# Altium schematic sheet HEATER-SSR.SchDoc
size D; SheetNumber: 5; SheetTotal: 7
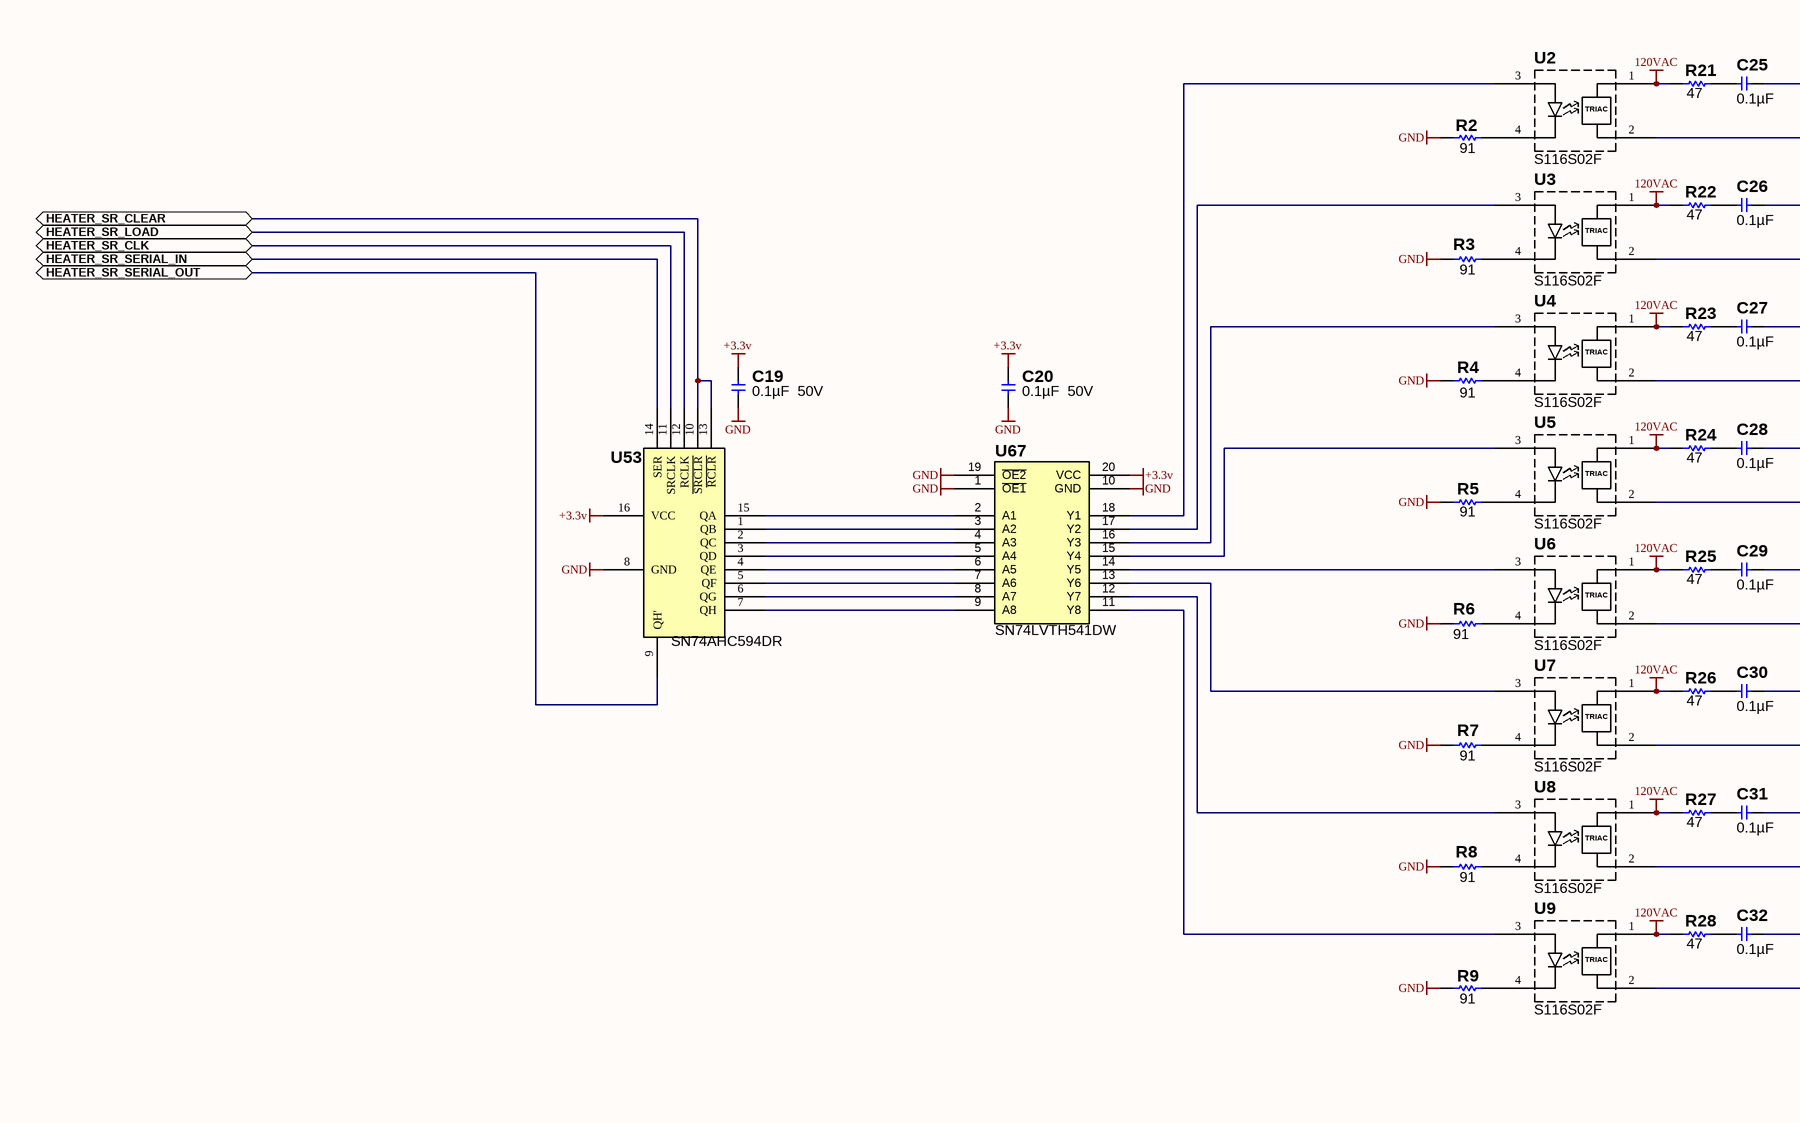
[diagram p0: HEATER-SSR.SchDoc, left]
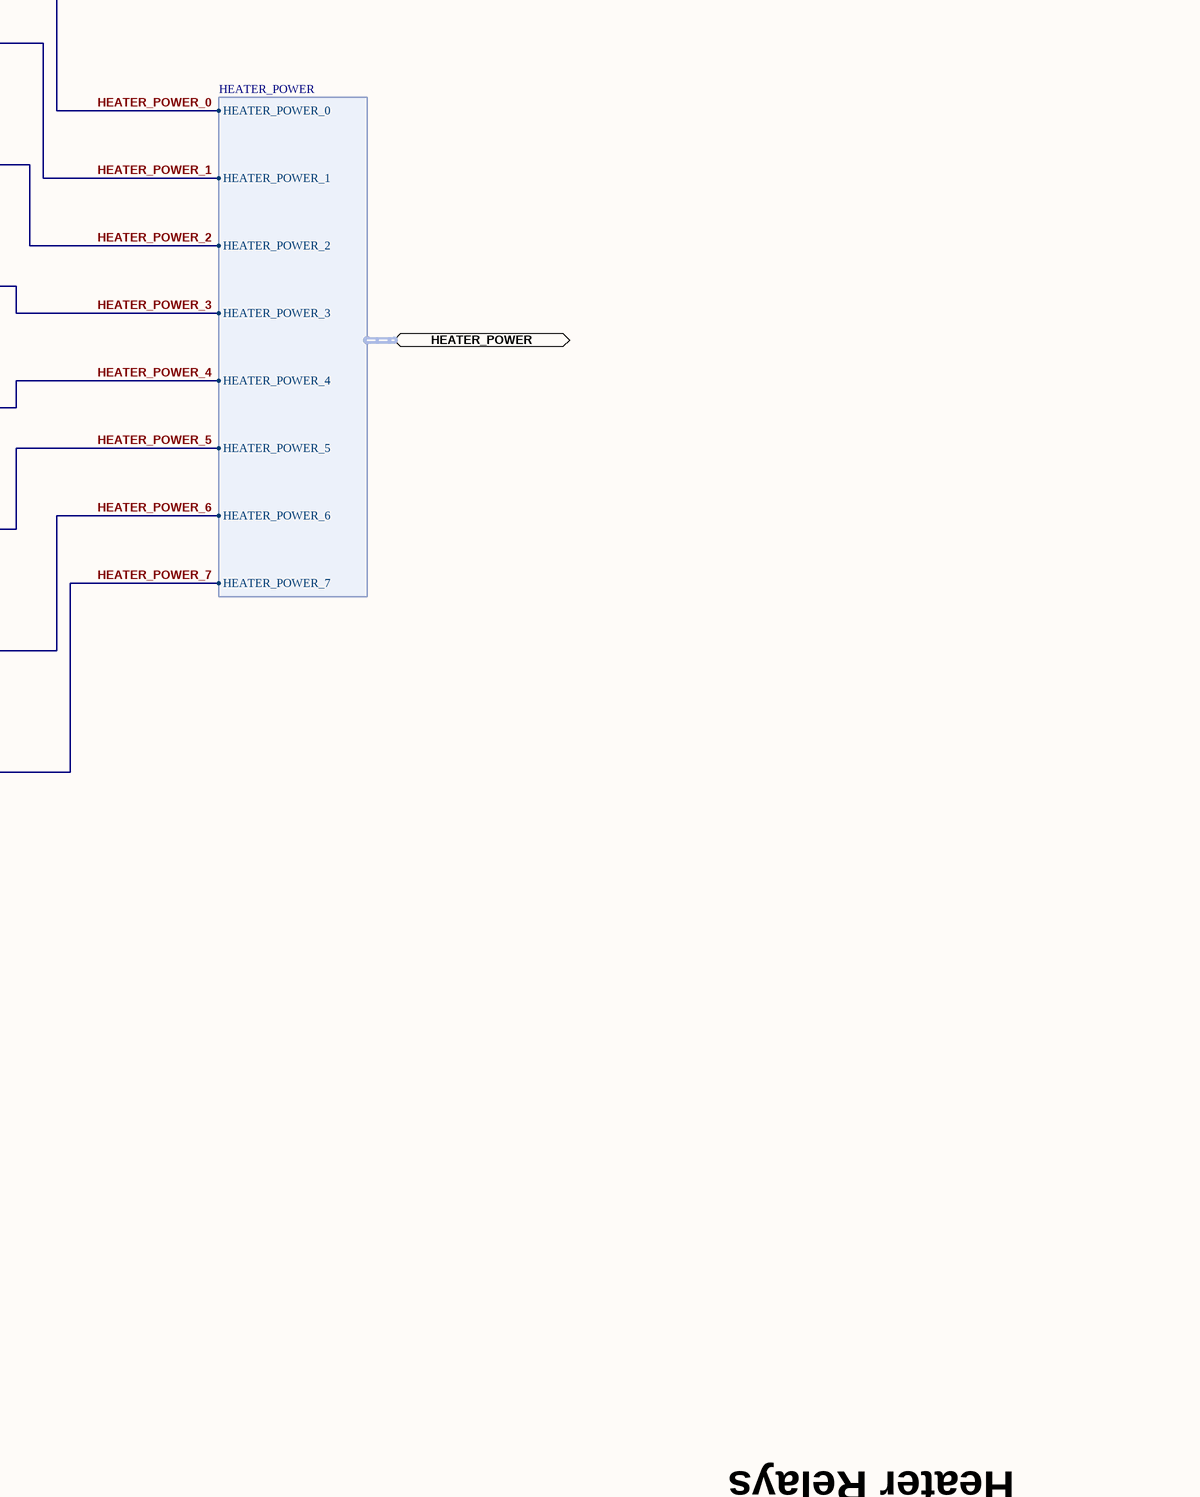
[diagram p1: HEATER-SSR.SchDoc, right]

## Parts
C19  0.1µF  50V  [C0805_LD]
C20  0.1µF  50V  [C0805_LD]
C25  0.1µF  [C1206_LD]
C26  0.1µF  [C1206_LD]
C27  0.1µF  [C1206_LD]
C28  0.1µF  [C1206_LD]
C29  0.1µF  [C1206_LD]
C30  0.1µF  [C1206_LD]
C31  0.1µF  [C1206_LD]
C32  0.1µF  [C1206_LD]
R2  91  [R0805_LD]
R3  91  [R0805_LD]
R4  91  [R0805_LD]
R5  91  [R0805_LD]
R6  91  [R0805_LD]
R7  91  [R0805_LD]
R8  91  [R0805_LD]
R9  91  [R0805_LD]
R21  47  [R1206_LD]
R22  47  [R1206_LD]
R23  47  [R1206_LD]
R24  47  [R1206_LD]
R25  47  [R1206_LD]
R26  47  [R1206_LD]
R27  47  [R1206_LD]
R28  47  [R1206_LD]
U2  S116S02F  [SHARP SIP-4 SSR]
U3  S116S02F  [SHARP SIP-4 SSR]
U4  S116S02F  [SHARP SIP-4 SSR]
U5  S116S02F  [SHARP SIP-4 SSR]
U6  S116S02F  [SHARP SIP-4 SSR]
U7  S116S02F  [SHARP SIP-4 SSR]
U8  S116S02F  [SHARP SIP-4 SSR]
U9  S116S02F  [SHARP SIP-4 SSR]
U53  SN74AHC594DR  [SOIC127P600X145-16L]
U67  SN74LVTH541DW  [SOIC127P1030X265-20L]

## Ports
HEATER_POWER (harness HEATER_POWER), HEATER_SR_CLEAR, HEATER_SR_CLK, HEATER_SR_LOAD, HEATER_SR_SERIAL_IN, HEATER_SR_SERIAL_OUT

## Harnesses
HEATER_POWER: HEATER_POWER_0, HEATER_POWER_1, HEATER_POWER_2, HEATER_POWER_3, HEATER_POWER_4, HEATER_POWER_5, HEATER_POWER_6, HEATER_POWER_7

## Nets
120VAC: R21.1 R22.1 R23.1 R24.1 R25.1 R26.1 R27.1 R28.1 U2.1 U3.1 U4.1 U5.1 U6.1 U7.1 U8.1 U9.1
+3.3v: C19.2 C20.2 U53.16(VCC) U67.20(VCC)
GND: C19.1 C20.1 R2.1 R3.1 R4.1 R5.1 R6.1 R7.1 R8.1 R9.1 U53.8(GND) U67.1(~{OE1}) U67.10(GND) U67.19(~{OE2})
HEATER_POWER_0: C25.2 U2.2 ; port HEATER_POWER.HEATER_POWER_0
HEATER_POWER_1: C26.2 U3.2 ; port HEATER_POWER.HEATER_POWER_1
HEATER_POWER_2: C27.2 U4.2 ; port HEATER_POWER.HEATER_POWER_2
HEATER_POWER_3: C28.2 U5.2 ; port HEATER_POWER.HEATER_POWER_3
HEATER_POWER_4: C29.2 U6.2 ; port HEATER_POWER.HEATER_POWER_4
HEATER_POWER_5: C30.2 U7.2 ; port HEATER_POWER.HEATER_POWER_5
HEATER_POWER_6: C31.2 U8.2 ; port HEATER_POWER.HEATER_POWER_6
HEATER_POWER_7: C32.2 U9.2 ; port HEATER_POWER.HEATER_POWER_7
HEATER_SR_CLEAR: U53.10(~{SRCLR}) U53.13(~{RCLR}) ; port HEATER_SR_CLEAR
HEATER_SR_CLK: U53.11(SRCLK) ; port HEATER_SR_CLK
HEATER_SR_LOAD: U53.12(RCLK) ; port HEATER_SR_LOAD
HEATER_SR_SERIAL_IN: U53.14(SER) ; port HEATER_SR_SERIAL_IN
HEATER_SR_SERIAL_OUT: U53.9(QH') ; port HEATER_SR_SERIAL_OUT
NetC25_1: C25.1 R21.2
NetC26_1: C26.1 R22.2
NetC27_1: C27.1 R23.2
NetC28_1: C28.1 R24.2
NetC29_1: C29.1 R25.2
NetC30_1: C30.1 R26.2
NetC31_1: C31.1 R27.2
NetC32_1: C32.1 R28.2
NetR2_2: R2.2 U2.4
NetR3_2: R3.2 U3.4
NetR4_2: R4.2 U4.4
NetR5_2: R5.2 U5.4
NetR6_2: R6.2 U6.4
NetR7_2: R7.2 U7.4
NetR8_2: R8.2 U8.4
NetR9_2: R9.2 U9.4
NetU2_3: U2.3 U67.18(Y1)
NetU3_3: U3.3 U67.17(Y2)
NetU4_3: U4.3 U67.16(Y3)
NetU5_3: U5.3 U67.15(Y4)
NetU6_3: U6.3 U67.14(Y5)
NetU7_3: U7.3 U67.13(Y6)
NetU8_3: U8.3 U67.12(Y7)
NetU9_3: U9.3 U67.11(Y8)
NetU53_1: U53.1(QB) U67.3(A2)
NetU53_2: U53.2(QC) U67.4(A3)
NetU53_3: U53.3(QD) U67.5(A4)
NetU53_4: U53.4(QE) U67.6(A5)
NetU53_5: U53.5(QF) U67.7(A6)
NetU53_6: U53.6(QG) U67.8(A7)
NetU53_7: U53.7(QH) U67.9(A8)
NetU53_15: U53.15(QA) U67.2(A1)

## Notes on the sheet
- Heater Relays
- -1
- Wavenumber LLC
- 2pl
- Rev:
- Sheet
- of
- (in symbol S116S02F) TRIAC

## Library data of the parts
C19 C20 = GRM21BR71H104KA01L: CAP CER 0.1UF 50V 10% X7R 0805; Manufacturer: Murata Electronics North America; Value: 0.1µF  50V; Temperature Coefficient: X7R; Manufacturer Part Number: GRM21BR71H104KA01L; ComponentLink1Description: \\altium.sil.arl.psu.edu\Libraries\datasheets\Murata Electronics North America\c02e.pdf; ComponentLink1URL: http://search.murata.co.jp/Ceramy/image/img/A01X/G101/ENG/GRM1555C1HR60WA01-01.pdf; ComponentLink2Description: External Datasheet; ComponentLink2URL: http://www.murata.com/products/catalog/pdf/c02e.pdf; Stocked: 0; Supplier 1: Digi-Key; Supplier Part Number 1: 490-1666-1-ND; Category: Capacitors; Sort Value: 100000; Sort Value Package: 0805_100000; Pricing: 1 = 0.1  ;  10 = 0.046  ;  50 = 0.0248  ;  100 = 0.0209  ;  250 = 0.01712  ;  500 = 0.01464  ;  1000 = 0.0114 (USD); Sales Status: Active; Capacitance: 0.1µF; Voltage - Rated: 50V; Tolerance: ±10%; Mounting Type: Surface Mount- MLCC; Operating Temperature: -55°C ~ 125°C; Applications: General Purpose; Ratings: -; Package / Case: 0805 (2012 Metric); Size / Dimension: 0.079" L x 0.049" W (2.00mm x 1.25mm); Height - Seated (Max): -; Thickness (Max): 0.053" (1.35mm); Lead Spacing: -; Features: -; Packaging: Cut Tape (CT); Lead Style: -; Package: 0805; Thickness: 135
C25-C32 = GRM31CR72E104KW03L: CAP CER 0.1UF 250V 10% X7R 1206; Manufacturer: Murata Electronics North America; Value: 0.1µF; Temperature Coefficient: X7R; Manufacturer Part Number: GRM31CR72E104KW03L; ComponentLink1Description: \\altium.sil.arl.psu.edu\Libraries\datasheets\Murata Electronics North America\c02e.pdf; ComponentLink1URL: http://search.murata.co.jp/Ceramy/image/img/A01X/G101/ENG/GRM1555C1HR60WA01-01.pdf; ComponentLink2Description: External Datasheet; ComponentLink2URL: http://www.murata.com/products/catalog/pdf/c02e.pdf; Stocked: 0; Supplier 1: Digi-Key; Supplier Part Number 1: 490-3542-1-ND; Category: Capacitors; Sort Value: 100000; Sort Value Package: 1206_100000; Pricing: 1 = 0.37  ;  10 = 0.308  ;  50 = 0.1732  ;  100 = 0.154  ;  250 = 0.11552  ;  500 = 0.10202  ;  1000 = 0.09048 (USD); Sales Status: Active; Capacitance: 0.1µF; Voltage - Rated: 250V; Tolerance: ±10%; Mounting Type: Surface Mount- MLCC; Operating Temperature: -55°C ~ 125°C; Applications: General Purpose; Ratings: -; Package / Case: 1206 (3216 Metric); Size / Dimension: 0.126" L x 0.063" W (3.20mm x 1.60mm); Height - Seated (Max): -; Thickness (Max): 0.071" (1.80mm); Lead Spacing: -; Features: -; Packaging: Cut Tape (CT); Lead Style: -; Package: 1206; Thickness: 180
R2-R9 = ERJ-6ENF91R0V: RES 91 OHM 1/8W 1% 0805 SMD; Manufacturer: Panasonic Electronic Components; Package Power: 0805  (0.125W); Power (Watts): 0.125W- 1/8W; Temperature Coefficient: ±100ppm/°C; Limiting Element Voltage: 150; Maximum Overload Voltage: 200; Maximum Working Voltage: 3.4V; Value: 91; Manufacturer Part Number: ERJ-6ENF91R0V; ComponentLink1Description: Internal Datasheet; ComponentLink1URL: \\altium.sil.arl.psu.edu\Libraries\datasheets\Panasonic Electronic Components\AOA0000CE2.pdf; ComponentLink2Description: External Datasheet; ComponentLink2URL: http://industrial.panasonic.com/www-data/pdf/AOA0000/AOA0000CE2.pdf; Stocked: 0; Supplier 1: Digi-Key; Supplier Part Number 1: P91.0CCT-ND; Category: Resistors; Resistance (Ohms): 91; Composition: Thick Film; Features: -; Tolerance: ±1%; Package / Case: 0805 (2012 Metric); Footprint: 805; Size / Dimension: 0.079" L x 0.049" W (2.00mm x 1.25mm); Height: 0.028" (0.70mm); Number of Terminations: 2; Packaging: Cut Tape (CT); Sort Value: 91; Sort Value Package: 805_91
R21-R28 = ERJ-8ENF47R0V: RES 47 OHM 1/4W 1% 1206 SMD; Manufacturer: Panasonic Electronic Components; Package Power: 1206  (0.25W); Power (Watts): 0.25W- 1/4W; Temperature Coefficient: ±100ppm/°C; Limiting Element Voltage: 200; Maximum Overload Voltage: 400; Maximum Working Voltage: 3.4V; Value: 47; Manufacturer Part Number: ERJ-8ENF47R0V; ComponentLink1Description: Internal Datasheet; ComponentLink1URL: \\altium.sil.arl.psu.edu\Libraries\datasheets\Panasonic Electronic Components\AOA0000CE2.pdf; ComponentLink2Description: External Datasheet; ComponentLink2URL: http://industrial.panasonic.com/www-data/pdf/AOA0000/AOA0000CE2.pdf; Stocked: 0; Supplier 1: Digi-Key; Supplier Part Number 1: P47.0FCT-ND; Category: Resistors; Resistance (Ohms): 47; Composition: Thick Film; Features: -; Tolerance: ±1%; Package / Case: 1206 (3216 Metric); Footprint: 1206; Size / Dimension: 0.126" L x 0.063" W (3.20mm x 1.60mm); Height: 0.028" (0.70mm); Number of Terminations: 2; Packaging: Cut Tape (CT); Sort Value: 47; Sort Value Package: 1206_47
U2-U9 = S116S02F: Solid State Relays - PCB Mount 16A Zero Cross Type Triac output SSR; Manufacturer: Sharp Microelectronics; Load Voltage Rating: 400 V; Supplier 1: Mouser; Manufacturer Part Number: S116S02F; RoHS: RoHS Compliant; Category: Solid State Relays - PCB Mount; Stock 1: 60; Pricing 1: 1=8.07, 10=6.66, 50=6.05, 100=5.85, 250=5.52, 500=5.24, 1000=5.04, 2500=4.83 (AUD); Package / Case: SIP-4; Series: S; Termination Style: Lead Termination; Mounting Style: Through Hole; Product Category: Solid State Relays; Product Type: PCB Mount; Standard Pack Qty: 200; RoHS - Mouser: Y; Minimum Order Quantity: 1; Reeling: False; ComponentLink1URL: http://www.mouser.com/ds/2/365/s216s02_e-184067.pdf; ComponentLink1Description: http://www.mouser.com/ds/2/365/s216s02_e-184067.pdf; Supplier Part Number 1: 852-S116S02F; Value: S116S02F
U53 = SN74AHC594DR: IC SHIFT REGISTER 8BIT 16-SOIC; Manufacturer: Texas Instruments; Output Type: Standard; Number of Elements: 1; Number of Bits per Element: 8; Function: Serial to Parallel; Voltage - Supply: 2 V ~ 5.5 V; Supplier 1: Digi-Key; Manufacturer Part Number: SN74AHC594DR; RoHS: RoHS Compliant; Category: Integrated Circuits (ICs); Stock 1: 1808; Pricing 1: 1=0.59, 10=0.494, 25=0.4332, 100=0.3708, 250=0.3216, 500=0.2724, 1000=0.21 (USD); Packaging: Cut Tape (CT); Logic Type: Shift Register; Operating Temperature: -40°C ~ 85°C; Mounting Type: Surface Mount; Package / Case: 16-SOIC (0.154", 3.90mm Width); Supplier Device Package: 16-SOIC N; ComponentLink1URL: http://www.ti.com/lit/ds/symlink/sn74ahc594.pdf; ComponentLink1Description: http://www.ti.com/lit/ds/symlink/sn74ahc594.pdf; Supplier Part Number 1: 296-31743-1-ND; Value: SN74AHC594DR
U67 = SN74LVTH541DW: IC BUFF/DVR TRI-ST 8BIT 20SOIC; Manufacturer: Texas Instruments; Logic Type: Buffer/Line Driver, Non-Inverting; Number of Elements: 1; Number of Bits per Element: 8; Current - Output High, Low: 32mA, 64mA; Voltage - Supply: 2.7 V ~ 3.6 V; Value: SN74LVTH541DW; Supplier 1: Digi-Key; Supplier Part Number 1: 296-8728-5-ND; Manufacturer Part Number: SN74LVTH541DW; RoHS: RoHS Compliant; Category: Integrated Circuits (ICs); Stock 1: 8053; Pricing 1: 1=2.02, 25=1.6252, 100=1.4625, 250=1.3, 500=1.1375, 1000=0.9425, 2500=0.8775, 5000=0.845, 10000=0.8125 (USD); Packaging: Tube; Operating Temperature: -40°C ~ 85°C; Mounting Type: Surface Mount; Package / Case: 20-SOIC (0.295", 7.50mm Width); Supplier Device Package: 20-SOIC; ComponentLink1URL: http://www.ti.com/lit/ds/symlink/sn74lvth541.pdf; ComponentLink1Description: http://www.ti.com/lit/ds/symlink/sn74lvth541.pdf